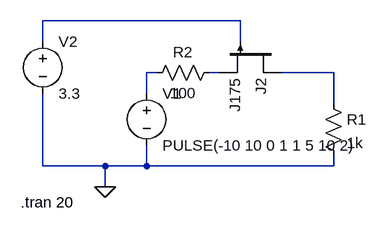
[diagram p0: schematic high-voltage-pin-protection.asc]
high-voltage-pin-protection.asc, the LTspice schematic file:
Version 4
SHEET 1 880 680
WIRE 224 80 -80 80
WIRE -80 112 -80 80
WIRE 224 112 224 80
WIRE 96 160 80 160
WIRE 192 160 176 160
WIRE 368 160 288 160
WIRE 80 192 80 160
WIRE 368 208 368 160
WIRE -80 304 -80 192
WIRE 16 304 -80 304
WIRE 80 304 80 272
WIRE 80 304 16 304
WIRE 368 304 368 288
WIRE 368 304 80 304
WIRE 16 336 16 304
FLAG 16 336 0
SYMBOL voltage 80 176 R0
WINDOW 123 0 0 Left 0
WINDOW 39 0 0 Left 0
SYMATTR InstName V1
SYMATTR Value PULSE(-10 10 0 1 1 5 10 2)
SYMBOL voltage -80 96 R0
SYMATTR InstName V2
SYMATTR Value 3.3
SYMBOL res 352 192 R0
SYMATTR InstName R1
SYMATTR Value 1k
SYMBOL pjf 288 112 R90
SYMATTR InstName J2
SYMATTR Value J175
SYMBOL res 192 144 R90
WINDOW 0 0 56 VBottom 2
WINDOW 3 32 56 VTop 2
SYMATTR InstName R2
SYMATTR Value 100
TEXT -114 360 Left 2 !.tran 20

The netlist it stands for:
* high-voltage-pin-protection.asc
V1 N002 0 PULSE(-10 10 0 1 1 5 10 2)
V2 N001 0 3.3
R1 N004 0 1k
J2 N004 N001 N003 J175
R2 N003 N002 100
.model NJF NJF
.model PJF PJF
.lib standard.jft
.tran 20
.backanno
.end